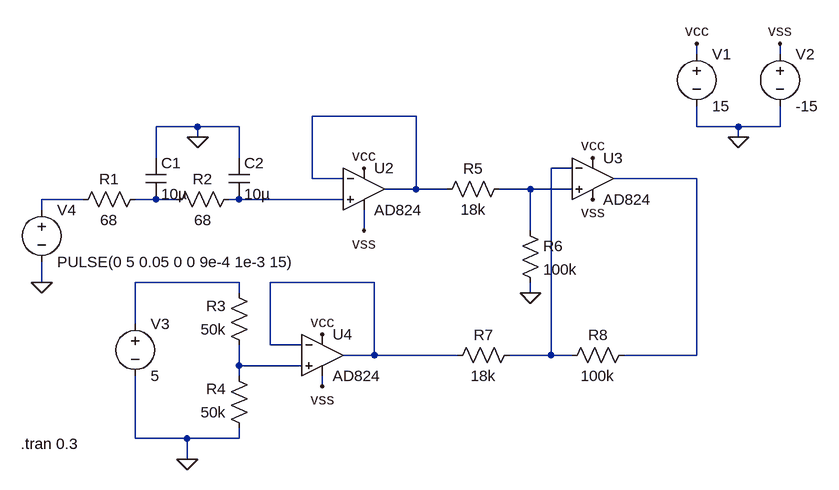
[diagram p0: schematic output_lvlshift.asc]
output_lvlshift.asc, the LTspice schematic file:
Version 4
SHEET 1 1112 680
WIRE 800 -80 800 -96
WIRE 928 -80 928 -96
WIRE 368 16 208 16
WIRE 32 32 -32 32
WIRE 96 32 32 32
WIRE 800 32 800 0
WIRE 864 32 800 32
WIRE 928 32 928 0
WIRE 928 32 864 32
WIRE 32 48 32 32
WIRE 864 48 864 32
WIRE -32 80 -32 32
WIRE 96 80 96 32
WIRE 608 96 576 96
WIRE 208 112 208 16
WIRE 256 112 208 112
WIRE 800 112 672 112
WIRE 368 128 368 16
WIRE 368 128 320 128
WIRE 416 128 368 128
WIRE 544 128 496 128
WIRE 608 128 544 128
WIRE -144 144 -208 144
WIRE -32 144 -64 144
WIRE 0 144 -32 144
WIRE 96 144 80 144
WIRE 256 144 96 144
WIRE -208 160 -208 144
WIRE 288 192 288 160
WIRE 544 192 544 128
WIRE -208 272 -208 240
WIRE 96 272 -64 272
WIRE 304 272 144 272
WIRE 96 288 96 272
WIRE 544 288 544 272
WIRE -64 336 -64 272
WIRE 144 368 144 272
WIRE 192 368 144 368
WIRE 304 384 304 272
WIRE 304 384 256 384
WIRE 432 384 304 384
WIRE 576 384 576 96
WIRE 576 384 512 384
WIRE 608 384 576 384
WIRE 800 384 800 112
WIRE 800 384 688 384
WIRE 96 400 96 368
WIRE 192 400 96 400
WIRE 96 416 96 400
WIRE 224 432 224 416
WIRE -64 512 -64 416
WIRE 16 512 -64 512
WIRE 96 512 96 496
WIRE 96 512 16 512
WIRE 16 544 16 512
FLAG 864 48 0
FLAG 800 -96 vcc
FLAG 928 -96 vss
FLAG 640 144 vss
FLAG 288 96 vcc
FLAG 640 80 vcc
FLAG 544 288 0
FLAG -208 272 0
FLAG 16 544 0
FLAG 224 352 vcc
FLAG 288 192 vss
FLAG 224 432 vss
FLAG 32 48 0
SYMBOL OpAmps\\AD824 288 64 R0
SYMATTR InstName U2
SYMBOL OpAmps\\AD824 640 48 R0
SYMATTR InstName U3
SYMBOL OpAmps\\AD824 224 320 R0
SYMATTR InstName U4
SYMBOL res 112 384 R180
WINDOW 0 36 76 Left 2
WINDOW 3 36 40 Left 2
SYMATTR InstName R3
SYMATTR Value 50k
SYMBOL res 112 512 R180
WINDOW 0 36 76 Left 2
WINDOW 3 36 40 Left 2
SYMATTR InstName R4
SYMATTR Value 50k
SYMBOL res 400 144 R270
WINDOW 0 32 56 VTop 2
WINDOW 3 0 56 VBottom 2
SYMATTR InstName R5
SYMATTR Value 18k
SYMBOL res 528 176 R0
SYMATTR InstName R6
SYMATTR Value 100k
SYMBOL res 528 368 R90
WINDOW 0 0 56 VBottom 2
WINDOW 3 32 56 VTop 2
SYMATTR InstName R7
SYMATTR Value 18k
SYMBOL res 592 400 R270
WINDOW 0 32 56 VTop 2
WINDOW 3 0 56 VBottom 2
SYMATTR InstName R8
SYMATTR Value 100k
SYMBOL voltage 800 -96 R0
WINDOW 123 0 0 Left 0
WINDOW 39 0 0 Left 0
SYMATTR InstName V1
SYMATTR Value 15
SYMBOL voltage 928 -96 R0
WINDOW 123 0 0 Left 0
WINDOW 39 0 0 Left 0
SYMATTR InstName V2
SYMATTR Value -15
SYMBOL voltage -64 320 R0
WINDOW 123 0 0 Left 0
WINDOW 39 0 0 Left 0
SYMATTR InstName V3
SYMATTR Value 5
SYMBOL voltage -208 144 R0
WINDOW 123 0 0 Left 0
WINDOW 39 0 0 Left 0
SYMATTR InstName V4
SYMATTR Value PULSE(0 5 0.05 0 0 9e-4 1e-3 15)
SYMBOL cap -48 80 R0
SYMATTR InstName C1
SYMATTR Value 10µ
SYMBOL cap 80 80 R0
SYMATTR InstName C2
SYMATTR Value 10µ
SYMBOL res -48 128 R90
WINDOW 0 0 56 VBottom 2
WINDOW 3 32 56 VTop 2
SYMATTR InstName R1
SYMATTR Value 68
SYMBOL res 96 128 R90
WINDOW 0 0 56 VBottom 2
WINDOW 3 32 56 VTop 2
SYMATTR InstName R2
SYMATTR Value 68
TEXT -240 520 Left 2 !.tran 0.3

The netlist it stands for:
* output_lvlshift.asc
XU2 N007 N001 vcc vss N001 AD824  ; pins In+ In- V+ V- OUT
XU3 N004 N002 vcc vss N003 AD824  ; pins In+ In- V+ V- OUT
XU4 N010 N009 vcc vss N009 AD824  ; pins In+ In- V+ V- OUT
R3 N010 N008 50k
R4 0 N010 50k
R5 N001 N004 18k
R6 N004 0 100k
R7 N002 N009 18k
R8 N002 N003 100k
V1 vcc 0 15
V2 vss 0 -15
V3 N008 0 5
V4 N005 0 PULSE(0 5 0.05 0 0 9e-4 1e-3 15)
C1 0 N006 10µ
C2 0 N007 10µ
R1 N006 N005 68
R2 N007 N006 68
.tran 0.3
.backanno
.end